# EAGLE design WiREDSchema (EAGLE 6.5.0)
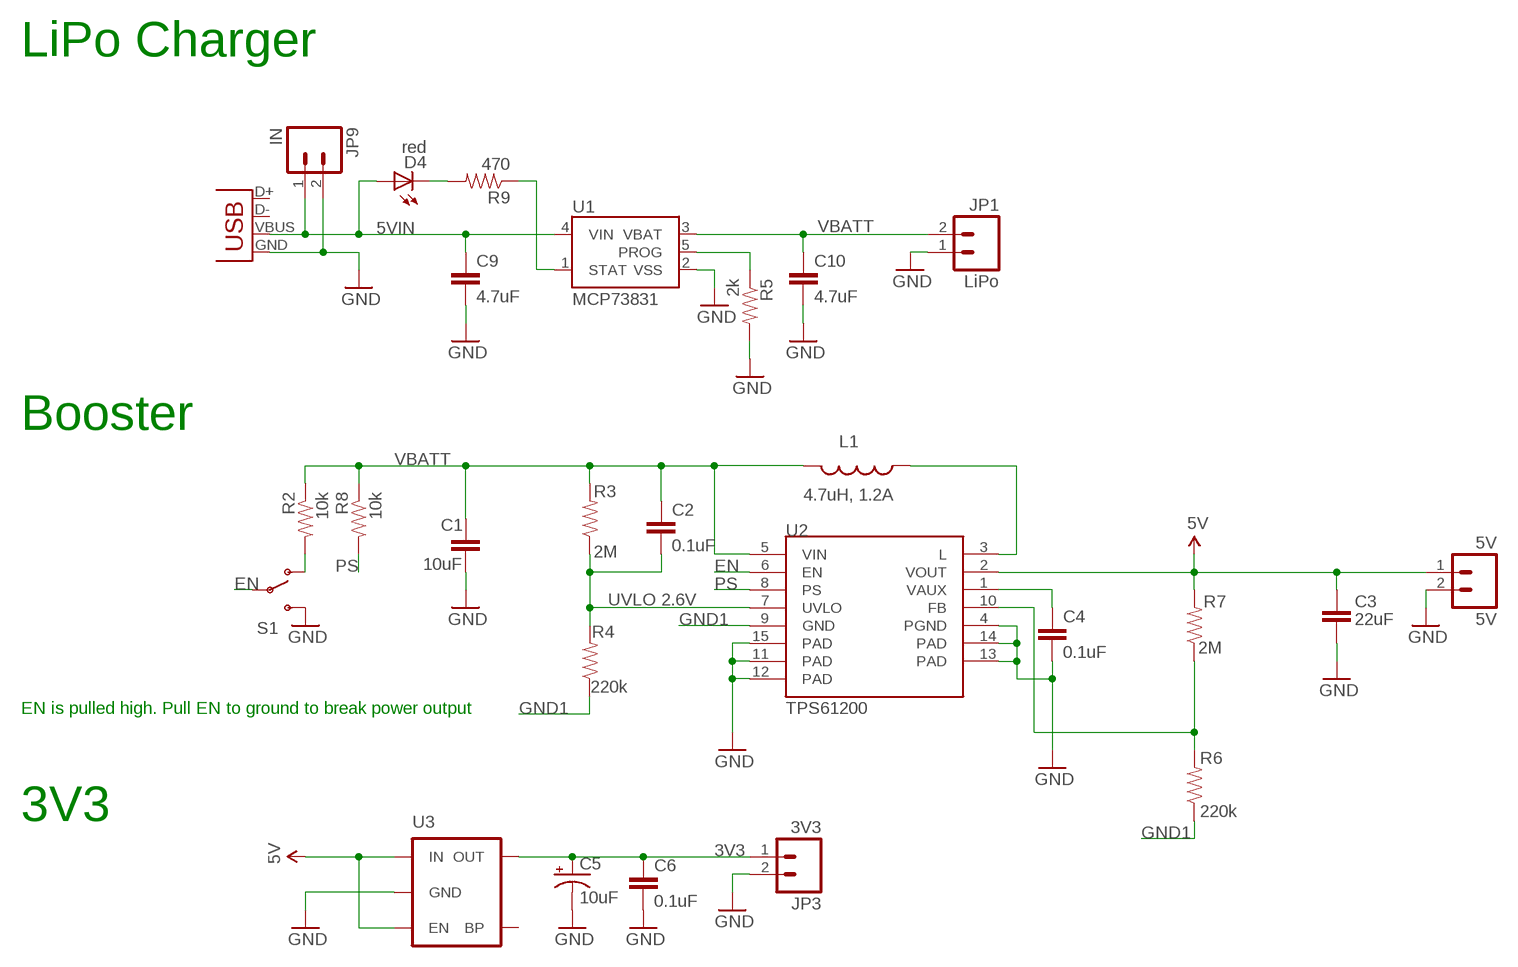
[diagram p0: schematic, sheet 1]

## Parts
5V  5V  M02PTH  [1X02]
C1  10uF  CAP1206  [1206]
C2  0.1uF  CAP0402-CAP  [0402-CAP]
C3  22uF  CAP0805  [0805]
C4  0.1uF  CAP0402-CAP  [0402-CAP]
C5  10uF  10UF-16V-10%(TANT)  [EIA3216]
C6  0.1uF  CAP0402-CAP  [0402-CAP]
C9  4.7uF  CAP0402-CAP  [0402-CAP]
C10  4.7uF  CAP0402-CAP  [0402-CAP]
D4  red  LED0603  [LED-0603]
JP1  LiPo  M02-JST-2MM-SMT  [JST-2-SMD]
JP3  3V3  M02PTH  [1X02]
JP9  IN  M02PTH  [1X02]
L1  4.7uH, 1.2A  INDUCTOR.  [CDRH2D09]
R2  10k  RESISTOR0402-RES  [0402-RES]
R3  2M  RESISTOR0402-RES  [0402-RES]
R4  220k  RESISTOR0402-RES  [0402-RES]
R5  2k  RESISTOR0402-RES  [0402-RES]
R6  220k  RESISTOR0402-RES  [0402-RES]
R7  2M  RESISTOR0402-RES  [0402-RES]
R8  10k  RESISTOR0402-RES  [0402-RES]
R9  470  RESISTOR0402-RES  [0402-RES]
S1  SWITCH-SPDTSMD  [AYZ0202]
U1  MCP73831  [SOT23-5]
U2  TPS61200  [QFN-10_PAD]
U3  MIC52053.3V  [SOT23-5]
X1  USB-MICROB  [USB-MICROB]

## Nets
3V3: C5.A(+) C6.1 JP3.1 U3.5(OUT)
5VIN: C9.1 D4.A JP9.1 U1.4(VIN) X1.VBUS
EN: S1.2(P) U2.6(EN)
FB: R6.2 R7.1 U2.10(FB)
GND: 5V.2 C1.2 C3.2 C4.2 C5.C(-) C6.2 C9.2 C10.2 JP1.1 JP3.2 JP9.2 R5.2 S1.3(S) U1.2(VSS) U2.4(PGND) U2.11(PAD) U2.12(PAD) U2.13(PAD) U2.14(PAD) U2.15(PAD) U3.2(GND) X1.GND
GND1: R4.1 R6.1 U2.9(GND)
N$1: C4.1 U2.1(VAUX)
N$2: L1.P$1 U2.3(L)
N$3: R2.2 S1.1(O)
N$8: D4.C R9.2
N$11: R5.1 U1.5(PROG)
N$14: R9.1 U1.1(STAT)
PS: R8.2 U2.8(PS)
UVLO: C2.2 R3.1 R4.2 U2.7(UVLO)
VBATT: C1.1 C2.1 C10.1 JP1.2 L1.P$2 R2.1 R3.2 R8.1 U1.3(VBAT) U2.5(VIN)
VCC: 5V.1 C3.1 R7.2 U2.2(VOUT) U3.1(IN) U3.3(EN) ; supply symbol labelled 5V
Unconnected: U3.4(BP) X1.D+ X1.D-

## Notes on the sheet
- LiPo Charger
- Booster
- Booster
- Booster
- LiPo Charger
- Booster | Booster
- UVLO 2.6V
- EN is pulled high. Pull EN to ground to break power output
- 3V3

## Library data of the parts
5V JP1 JP3 JP9 = SparkFun:M02: Header 2 Standard 2-pin 0.1" header. Use with straight break away headers (SKU : PRT-00116), right angle break away headers (PRT-00553), swiss pins (PRT-00743), machine pins (PRT-00117), and female headers (PRT-00115). Molex polarized connector foot print use with SKU : PRT-08233 with associated crimp pins and housings.; OC_FARNELL: unknown
C1 = CH_passive:CAP: Capacitor Standard 0603 ceramic capacitor, and 0.1" leaded capacitor.; MF: AVX; MPN: 12066D106KAT2A; OC_FARNELL: 1301815
C2 C4 C6 = SparkFun:CAP: Capacitor Standard 0603 ceramic capacitor, and 0.1" leaded capacitor.; MF: AVX; MPN: 04026D104KAT2A; OC_FARNELL: 1327657
C3 = CH_passive:CAP: Capacitor Standard 0603 ceramic capacitor, and 0.1" leaded capacitor.; MF: KEMET; MPN: C0805C226M9PACTU; OC_FARNELL: 1108326
C5 = SparkFun-Capacitors:10UF-16V-10%(TANT): CAP-00811 1206/EIA-3216 Tantalum capacitor; MF: AVX; MPN: TAJA106K006RNJ; OC_FARNELL: 197014; PROD_ID: CAP-00811
C9 C10 = SparkFun:CAP: Capacitor Standard 0603 ceramic capacitor, and 0.1" leaded capacitor.; MF: TAIYO YUDEN; MPN: JMK105BBJ475MV-F; OC_FARNELL: 1894512
D4 = SparkFun:LED: LEDs Standard schematic elements and footprints for 5mm, 3mm, 1206, and 0603 sized LEDs. 5mm - Spark Fun Electronics SKU : COM-00529 (and others); MF: VISHAY; MPN: TLMS1100-GS08.; OC_FARNELL: 1779660
L1 = SparkFun:INDUCTOR: Inductors Basic Inductor/Choke - 0603 and 1206. Footprints are not proven and vary greatly between part numbers.; MF: BOURNS; MPN: SRR4011-4R7YL; OC_FARNELL: 1828155
R2 R8 = SparkFun:RESISTOR: Resistor Basic schematic elements and footprints for 0603, 1206, and PTH resistors.; MF: TE CONNECTIVITY; MPN: CRG0402J10K; OC_FARNELL: 1174160
R3 R7 = SparkFun:RESISTOR: Resistor Basic schematic elements and footprints for 0603, 1206, and PTH resistors.; MF: PANASONIC; MPN: ERJ2GEJ205X; OC_FARNELL: 2059257
R4 R6 = SparkFun:RESISTOR: Resistor Basic schematic elements and footprints for 0603, 1206, and PTH resistors.; MF: PANASONIC; MPN: ERJ2GEJ224X; OC_FARNELL: 2059254
R5 = SparkFun:RESISTOR: Resistor Basic schematic elements and footprints for 0603, 1206, and PTH resistors.; MF: PANASONIC; MPN: ERJ2RKF2001X; OC_FARNELL: 2059132
R9 = SparkFun:RESISTOR: Resistor Basic schematic elements and footprints for 0603, 1206, and PTH resistors.; MF: TE CONNECTIVITY; MPN: CRG0402F470R; OC_FARNELL: 2331533
S1 = SparkFun-Electromechanical:SWITCH-SPDT: SPDT Switch Simple slide switch, Spark Fun Electronics SKU : COM-00102 DPDT SMT slide switch, AYZ0202, SWCH-08179; OC_FARNELL: unknown; PROD_ID: SWCH-08179
U1 = SparkFun:MCP73831: Microchip's MCP73831 Miniature single cell, fully integrated Li-Ion, Li-polymer charge management controller http://ww1.microchip.com/downloads/en/DeviceDoc/21984a.pdf; MF: MICROCHIP; MPN: MCP73831T-2ACI/OT; OC_FARNELL: 1332158
U2 = SparkFun:TPS61200: DC to DC Booster; MF: TEXAS INSTRUMENTS; MPN: TPS61200DRCTG4; OC_FARNELL: 1366268
U3 = SparkFun-PowerIC:MIC5205: MIC5205 150mA vreg 3.3V - VREG-00822 5V - VREG-00823; MF: MICREL SEMICONDUCTOR; MPN: MIC5205YM5 TR; OC_FARNELL: 1100654; PROD_ID: VREG-00822
X1 = SparkFun:USB: USB Connectors USB-B-PTH is fully proven SKU : PRT-00139 USB-miniB is fully proven SKU : PRT-00587 USB-A-PCB is untested. USB-A-H is throughly reviewed, but untested. Spark Fun Electronics SKU : PRT-00437 USB-B-SMT is throughly reviewed, but untested. Needs silkscreen touching up. USB-A-S has not been used/tested USB-MB-H has not been used/tested; OC_FARNELL: unknown

## Board
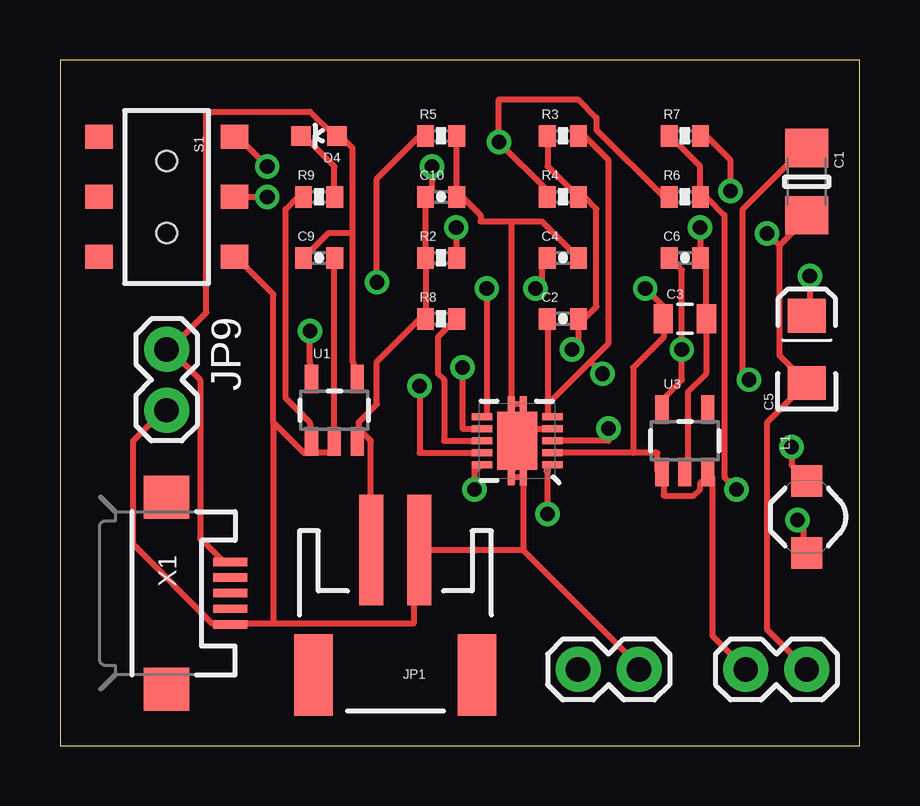
[diagram p1: board, top side]
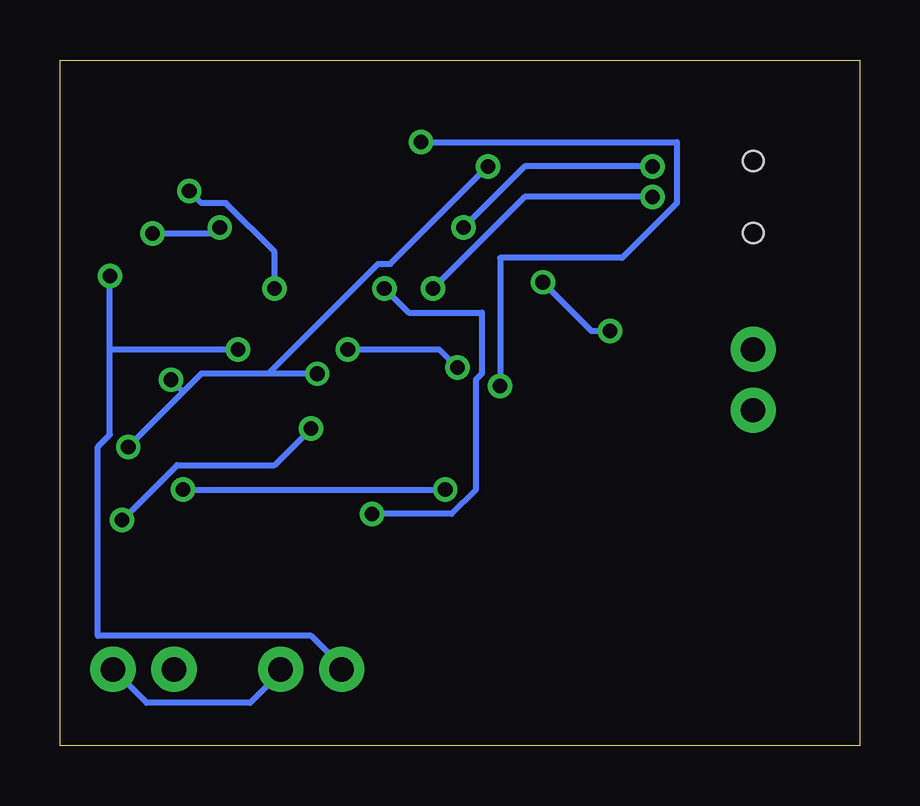
[diagram p2: board, bottom side, seen from below]

Size 33.33 x 28.57 mm. Coordinates in mm from the lower left corner, seen from the top.
Outline: 0,0 33.33,0 33.33,28.57 0,28.57 0,0
Copper layers (1*16): Top 0.035mm / dielectric 1.5mm / Bottom 0.035mm
Design rules "default": minimum track width 10mil, minimum drill 24mil, track to track 8mil, track to pad 8mil, pad to pad 8mil, via to via 8mil, smd to smd 8mil, copper to edge 40mil, drill to drill 8mil, minimum pad ring 10mil, minimum via ring 8mil, stop-mask expansion 4mil, vias tented up to drill 0mil, thermal gap 10mil

### Footprints (pad centres in the part's own frame; a part is rotated, then mirrored left to right if it is on the bottom)
1X02 = drill 1.016 pad 1.88: 1 0,0; 2 2.54,0
1206 = smd 1.6 x 1.8: 1 -1.4,0; 2 1.4,0
0402-CAP = smd 0.7 x 0.9: 1 -0.65,0; 2 0.65,0
0805 = smd 0.8 x 1.2: 1 -0.9,0; 2 0.9,0
EIA3216 = smd 1.4 x 1.6: A 1.4,0; C -1.4,0
LED-0603 = smd 0.8 x 0.8: A 0,-0.75; C 0,0.75
JST-2-SMD = smd 1 x 4.6: 1 -1,-3.7; 2 1,-3.7 | smd 1.6 x 3.4: NC1 -3.4,1.5; NC2 3.4,1.5
CDRH2D09 = smd 1.3 x 1.3: P$1 -1.5,0; P$2 1.5,0
0402-RES = smd 0.7 x 0.9: 1 -0.65,0; 2 0.65,0
AYZ0202 = smd 1 x 1.15: 1 -2.5,2.825; 2 0,2.825; 3 2.5,2.825; 4 -2.5,-2.825; 5 0,-2.825; 6 2.5,-2.825 | hole 0.85: 1.5,0; -1.5,0
SOT23-5 = smd 0.55 x 1.2: 1 -0.95,-1.3; 2 0,-1.3; 3 0.95,-1.3; 4 0.95,1.3; 5 -0.95,1.3
QFN-10_PAD = smd 0.297 x 0.85: 1 -1,-1.475; 2 -0.5,-1.475; 3 0,-1.475; 4 0.5,-1.475; 5 1,-1.475; 6 1,1.475; 7 0.5,1.475; 8 0,1.475; 9 -0.5,1.475; 10 -1,1.475 | smd 0.7 x 0.28: 11 -1.5,0.25; 12 -1.5,-0.25; 13 1.5,0.25; 14 1.5,-0.25 | smd 2.4 x 1.65: 15 0,0
USB-MICROB = smd 0.35 x 1.4: D+ 0,2.65; D- -0.65,2.65; GND 1.3,2.65; ID 0.65,2.65; VBUS -1.3,2.65 | smd 1.8 x 1.9: MT1 -4,0; MT2 4,0

### Placement (x,y rotation side)
5V  28.57,3.17 0 top
C1  31.11,23.5 270 top
C2  20.95,17.78 0 top
C3  26.04,17.78 0 top
C4  20.95,20.32 0 top
C5  31.11,16.51 90 top
C6  26.04,20.32 0 top
C9  10.79,20.32 0 top
C10  15.88,22.86 0 top
D4  10.79,25.4 90 top
JP1  13.97,4.45 180 top
JP3  21.59,3.17 0 top
JP9  4.45,16.51 270 top
L1  31.11,9.53 90 top
R2  15.88,20.32 0 top
R3  20.95,25.4 0 top
R4  20.95,22.86 0 top
R5  15.88,25.4 0 top
R6  26.04,22.86 0 top
R7  26.04,25.4 0 top
R8  15.88,17.78 0 top
R9  10.79,22.86 0 top
S1  4.45,22.86 270 top
U1  11.43,13.97 0 top
U2  19.05,12.7 90 top
U3  26.04,12.7 0 top
X1  4.45,6.35 270 top

### Tracks (layer width: path | path; a pad name or v marks a point on that pad's centre or on a via)
3V3  (via drill 0.61)
  Top 0.254: C6.1 25.91,19.81 v25.91,16.51 25.91,15.24 25.15,14.48 25.15,14.22 U3.5 | v31.24,19.56 31.24,18.03 C5.A
  Bottom 0.254: 31.24,16.51 31.24,12.95 31.75,12.45 31.75,4.57 22.86,4.57 21.59,3.3 JP3.1 | 31.24,16.51 v31.24,19.56 | 31.24,16.51 v25.91,16.51
5VIN
  Top 0.254: 12.19,21.34 12.19,16 U1.4 | 12.19,21.34 12.19,24.89 11.68,25.4 D4.A 11.43,25.4 10.41,26.42 6.1,26.42 6.1,18.03 4.57,16.51 | 12.19,21.34 11.18,21.34 10.16,20.32 C9.1 | 4.57,16.51 5.84,15.24 5.84,8.64 6.86,7.62 X1.VBUS | 4.57,16.51 JP9.1
EN  (via drill 0.61)
  Top 0.254: v17.78,19.05 17.78,13.72 U2.6 | S1.2 v8.64,22.86
  Bottom 0.254: v17.78,19.05 13.97,22.86 v8.64,22.86
FB  (via drill 0.61)
  Top 0.254: v17.27,10.67 17.27,11.43 17.53,11.68 U2.10 | v28.19,10.67 27.69,11.18 27.69,22.1 26.92,22.86 R6.2 26.67,24.13 R7.1
  Bottom 0.254: v28.19,10.67 v17.27,10.67
GND  (via drill 0.61)
  Top 0.254: C9.2 11.43,20.32 U1.2 11.43,12.19 10.16,12.19 8.89,13.46 | 8.89,13.46 8.89,18.8 7.37,20.32 S1.3 | 8.89,5.08 7.11,5.08 X1.GND 6.86,5.08 6.35,5.08 3.05,8.38 3.05,12.7 4.32,13.97 JP9.2 | 8.89,13.46 8.89,5.08 | C3.2 26.92,20.32 C6.2 v26.67,21.59 | C3.2 26.92,15.49 26.16,14.73 26.16,11.43 U3.2 | C3.2 | 29.97,20.83 29.97,16.26 30.99,15.24 C5.C 30.99,14.99 29.46,13.46 29.46,4.83 5V.2 | 29.97,20.83 30.99,21.84 C1.2 | 18.8,14.22 19.3,14.22 U2.14 19.3,13.97 19.3,13.21 | 19.3,11.18 18.8,11.18 U2.11 18.8,11.43 19.05,11.68 U2.15 | 19.3,13.21 19.05,13.21 U2.15 | 19.3,13.21 20.32,13.21 U2.4 | 19.3,13.21 U2.15 | R5.2 C10.2 16.76,22.86 17.53,22.1 17.53,21.84 18.8,21.84 | 18.8,21.84 20.07,21.84 C4.2 | 18.8,21.84 18.8,14.22 | 18.8,14.22 U2.13 | 19.3,8.13 24.13,3.3 JP3.2 | 19.3,11.18 19.3,8.13 | 19.3,11.18 U2.12 | 29.97,20.83 v29.46,21.34 | 19.3,8.13 14.99,8.13 JP1.1 14.73,8.13 14.73,5.08 8.89,5.08
  Bottom 0.254: 5V.2 29.72,1.78 25.4,1.78 24.13,3.05 JP3.2 | v26.67,21.59 26.92,21.34 v29.46,21.34
GND1  (via drill 0.61)
  Top 0.254: v14.99,14.99 14.99,12.19 17.53,12.19 U2.9 | R4.1 20.32,22.86 20.32,23.11 v18.29,25.15 18.29,26.92 21.59,26.92 22.35,26.16 22.35,25.65 25.15,22.86 R6.1
  Bottom 0.254: v14.99,14.99 14.99,20.32 9.91,20.32 7.62,22.61 7.62,25.15 v18.29,25.15
N$1  (via drill 0.61)
  Top 0.254: v20.32,9.65 20.32,11.68 U2.1 | v19.81,19.05 20.07,19.3 20.07,20.32 C4.1
  Bottom 0.254: v20.32,9.65 17.02,9.65 16,10.67 16,15.24 15.75,15.49 15.75,18.03 18.8,18.03 v19.81,19.05
N$2  (via drill 0.61)
  Top 0.254: U2.3 22.86,12.7 v22.86,13.21 | v30.73,9.4 30.99,9.14 30.99,8.13 L1.P$1
  Bottom 0.254: v22.86,13.21 24.38,11.68 28.45,11.68 v30.73,9.4
N$3  (via drill 0.61)
  Top 0.254: v16.51,21.59 R2.2 | v8.64,24.13 7.37,25.4 S1.1
  Bottom 0.254: v16.51,21.59 13.97,24.13 v8.64,24.13
N$8
  Top 0.254: D4.C 10.16,25.4 11.43,24.13 11.43,22.86 R9.2
N$11  (via drill 0.61)
  Top 0.254: v13.21,19.3 13.21,23.62 14.99,25.4 R5.1 | v10.41,17.27 10.41,16 U1.5
  Bottom 0.254: v13.21,19.3 11.18,17.27 v10.41,17.27
N$14
  Top 0.254: R9.1 9.91,22.86 9.4,22.35 9.4,14.48 10.41,13.46 U1.1
PS
  Top 0.254: U2.8 16,12.7 16,15.24 15.75,15.49 15.75,17.02 R8.2
UVLO  (via drill 0.61)
  Top 0.254: R3.1 20.32,25.4 20.32,24.13 R4.2 21.84,22.86 22.35,22.35 22.35,18.29 21.84,17.78 C2.2 21.59,16.76 v21.34,16.51 | v16.76,15.75 16.76,13.21 17.53,13.21 U2.7
  Bottom 0.254: v16.76,15.75 17.53,16.51 v21.34,16.51
VBATT  (via drill 0.61)
  Top 0.254: 15.24,20.32 15.24,17.78 R8.1 14.99,17.78 13.21,16 13.21,14.22 12.45,13.46 U1.3 12.45,13.21 12.95,12.7 12.95,8.38 JP1.2 | 15.24,20.32 15.24,22.86 | 15.24,20.32 R2.1 | 20.32,14.22 20.32,17.78 C2.1 | 20.32,14.22 20.32,13.72 U2.5 | 20.32,14.22 22.1,16 | 22.1,16 22.86,16.76 22.86,24.38 21.84,25.4 R3.2 | v30.48,12.45 30.48,11.68 30.99,11.18 L1.P$2 | 22.1,16 v22.61,15.49 | v28.7,15.24 28.45,15.49 28.45,22.35 30.99,24.89 C1.1 | 15.24,22.86 15.49,23.11 v15.49,24.13 | 15.24,22.86 C10.1
  Bottom 0.254: 28.19,14.73 27.43,15.49 24.64,15.49 | 28.19,14.73 v30.48,12.45 | v22.61,15.49 24.64,15.49 | 28.19,14.73 v28.7,15.24 | v15.49,24.13 19.56,20.07 20.07,20.07 24.64,15.49
VCC  (via drill 0.61)
  Top 0.254: 23.88,12.19 24.89,12.19 24.89,11.43 U3.1 25.15,11.18 25.15,10.41 26.42,10.41 26.67,10.67 26.67,10.92 26.92,11.18 U3.3 27.18,11.18 27.18,4.57 5V.1 | 23.88,12.19 20.57,12.19 U2.2 | v27.94,23.11 27.94,24.38 26.92,25.4 R7.2 | v24.38,19.05 25.15,18.29 C3.1 | 23.88,12.19 23.88,15.75 25.15,17.02 C3.1 | C3.1
  Bottom 0.254: v27.94,23.11 27.43,22.61 26.42,22.61 24.38,20.57 v24.38,19.05